# EAGLE design DesignBlockTest (EAGLE 9.6.2)
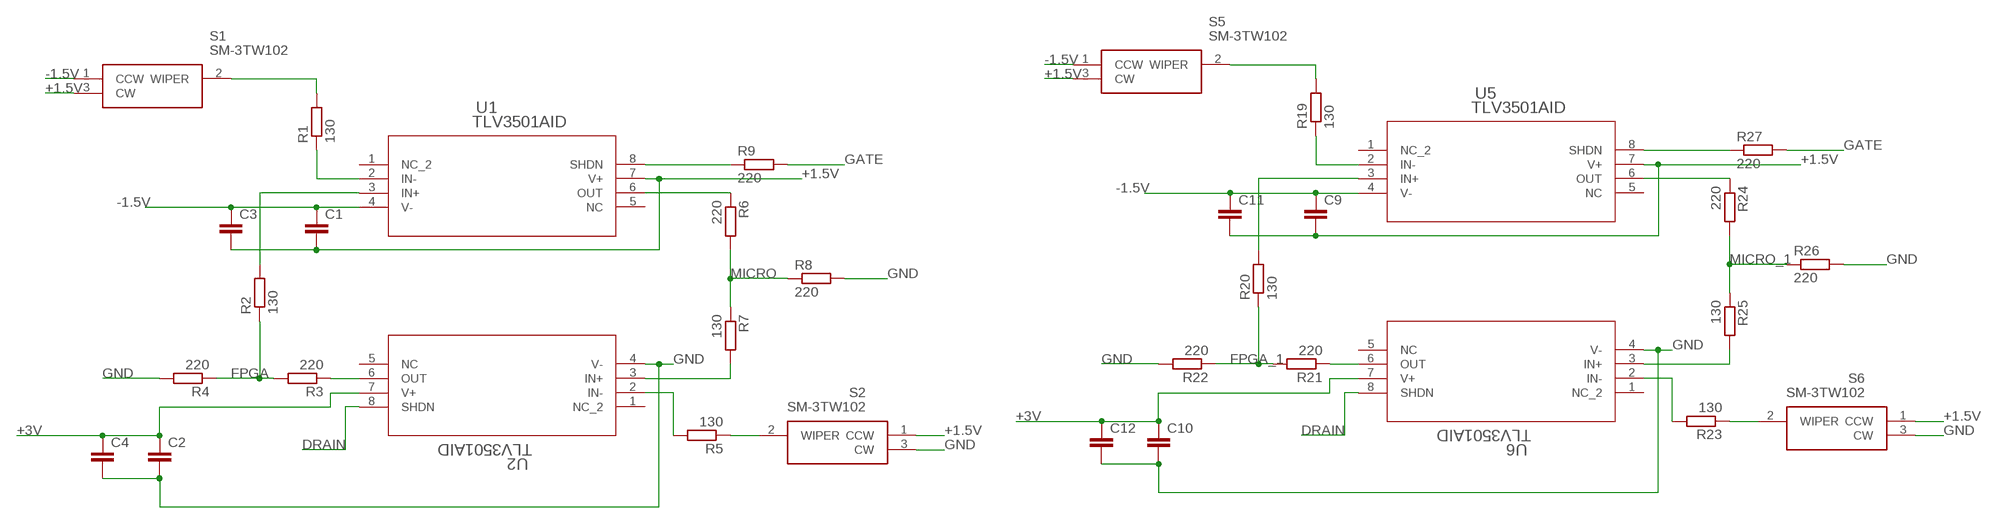
[diagram p0: schematic, sheet 1]

## Parts
C1  C-EUC0805  [C0805]
C2  C-EUC0805  [C0805]
C3  C-EUC0805  [C0805]
C4  C-EUC0805  [C0805]
C9  C-EUC0805  [C0805]
C10  C-EUC0805  [C0805]
C11  C-EUC0805  [C0805]
C12  C-EUC0805  [C0805]
R1  130  R-EU_R0805  [R0805]
R2  130  R-EU_R0603  [R0603]
R3  220  R-EU_R0805  [R0805]
R4  220  R-EU_R0805  [R0805]
R5  130  R-EU_R0805  [R0805]
R6  220  R-EU_R0805  [R0805]
R7  130  R-EU_R0805  [R0805]
R8  220  R-EU_R0805  [R0805]
R9  220  R-EU_R0805  [R0805]
R19  130  R-EU_R0805  [R0805]
R20  130  R-EU_R0603  [R0603]
R21  220  R-EU_R0805  [R0805]
R22  220  R-EU_R0805  [R0805]
R23  130  R-EU_R0805  [R0805]
R24  220  R-EU_R0805  [R0805]
R25  130  R-EU_R0805  [R0805]
R26  220  R-EU_R0805  [R0805]
R27  220  R-EU_R0805  [R0805]
S1  SM-3TW102  [SM3TW102]
S2  SM-3TW102  [SM3TW102]
S5  SM-3TW102  [SM3TW102]
S6  SM-3TW102  [SM3TW102]
U1  TLV3501AID  [D8]
U2  TLV3501AID  [D8]
U5  TLV3501AID  [D8]
U6  TLV3501AID  [D8]

## Nets
+1.5V: C1.2 C3.2 C9.2 C11.2 S1.3(CW) S2.1(CCW) S5.3(CW) S6.1(CCW) U1.7(V+) U5.7(V+)
+3V: C2.1 C4.1 C10.1 C12.1 U2.7(V+) U6.7(V+)
-1.5V: C1.1 C3.1 C9.1 C11.1 S1.1(CCW) S5.1(CCW) U1.4(V-) U5.4(V-)
DRAIN: U2.8(SHDN) U6.8(SHDN)
FPGA: R2.1 R3.2 R4.1
FPGA_1: R20.1 R21.2 R22.1
GATE: R9.2 R27.2
GND: C2.2 C4.2 C10.2 C12.2 R4.2 R8.2 R22.2 R26.2 S2.3(CW) S6.3(CW) U2.4(V-) U6.4(V-)
MICRO: R6.2 R7.1 R8.1
MICRO_1: R24.2 R25.1 R26.1
N$1: R1.2 S1.2(WIPER)
N$2: R1.1 U1.2(IN-)
N$3: R2.2 U1.3(IN+)
N$5: R3.1 U2.6(OUT)
N$6: R5.1 S2.2(WIPER)
N$7: R5.2 U2.2(IN-)
N$8: R7.2 U2.3(IN+)
N$10: R6.1 U1.6(OUT)
N$11: R9.1 U1.8(SHDN)
N$19: R19.2 S5.2(WIPER)
N$20: R19.1 U5.2(IN-)
N$21: R20.2 U5.3(IN+)
N$22: R21.1 U6.6(OUT)
N$23: R23.1 S6.2(WIPER)
N$24: R23.2 U6.2(IN-)
N$25: R25.2 U6.3(IN+)
N$26: R24.1 U5.6(OUT)
N$27: R27.1 U5.8(SHDN)
Unconnected: U1.1(NC_2) U1.5(NC) U2.1(NC_2) U2.5(NC) U5.1(NC_2) U5.5(NC) U6.1(NC_2) U6.5(NC)

## Library data of the parts
C1-C4 C9-C12 = rcl:C-EU: CAPACITOR, European symbol; SPICEPREFIX: C
R1-R9 R19-R27 = rcl:R-EU_: RESISTOR, European symbol; SPICEPREFIX: R
S1 S2 S5 S6 = SM-3TW102:SM-3TW102: Trimmer Resistors - SMD 1 KW 3mm SMD multi turn J-lead, top adj., 11 turn Source: Datasheet <https://www.mouser.it/ProductDetail/Nidec-Copal/SM-3TW102/?qs=XeJtXLiO41QfszlUsJazpw==>; DESCRIPTION: Trimmer Resistors - SMD 1 KW 3mm SMD multi turn J-lead, top adj., 11 turn; HEIGHT: 4.5mm; MANUFACTURER_NAME: NIDEC COPAL; MANUFACTURER_PART_NUMBER: SM-3TW102; MOUSER_PART_NUMBER: 229-SM-3TW102; MOUSER_PRICE-STOCK: https://www.mouser.co.uk/ProductDetail/Nidec-Copal/SM-3TW102?qs=XeJtXLiO41QfszlUsJazpw%3D%3D
U1 U2 U5 U6 = TLV3501:TLV3501AID; COPYRIGHT: Copyright (C) 2022 Ultra Librarian. All rights reserved.; DIGI-KEY_PART_NUMBER_1: 296-17921-5-ND; DIGI-KEY_PART_NUMBER_2: 2156-TLV3501AID-ND; MANUFACTURER_PART_NUMBER: TLV3501AID; MFR_NAME: Texas Instruments

## Board
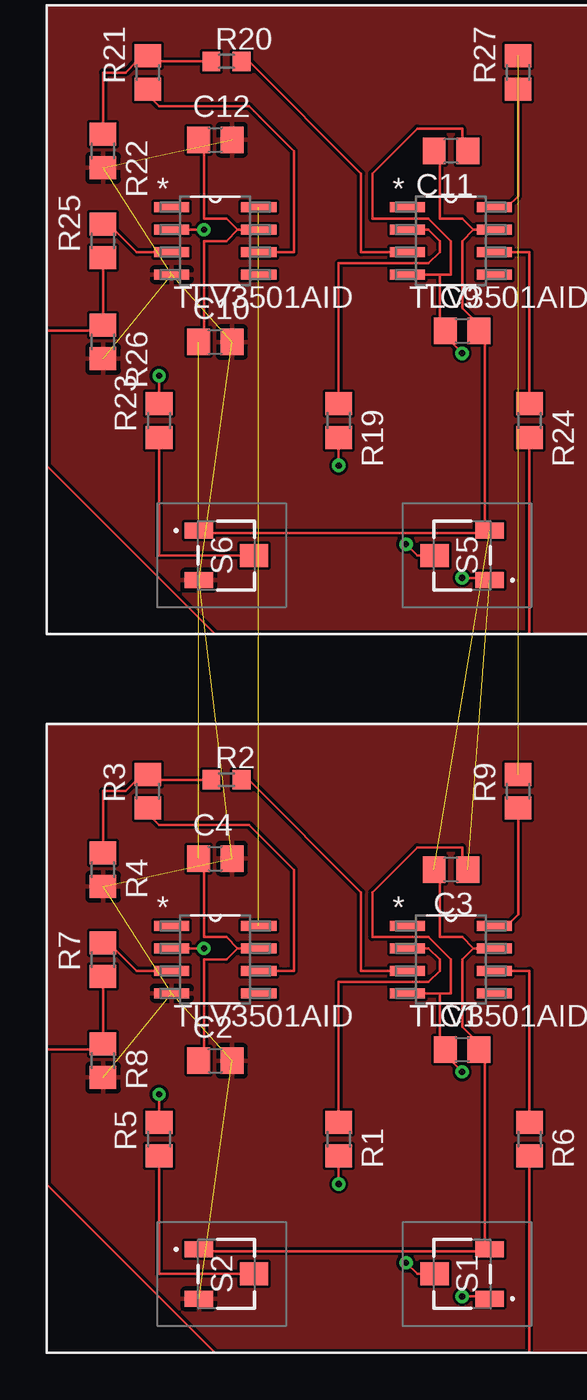
[diagram p1: board, top side]
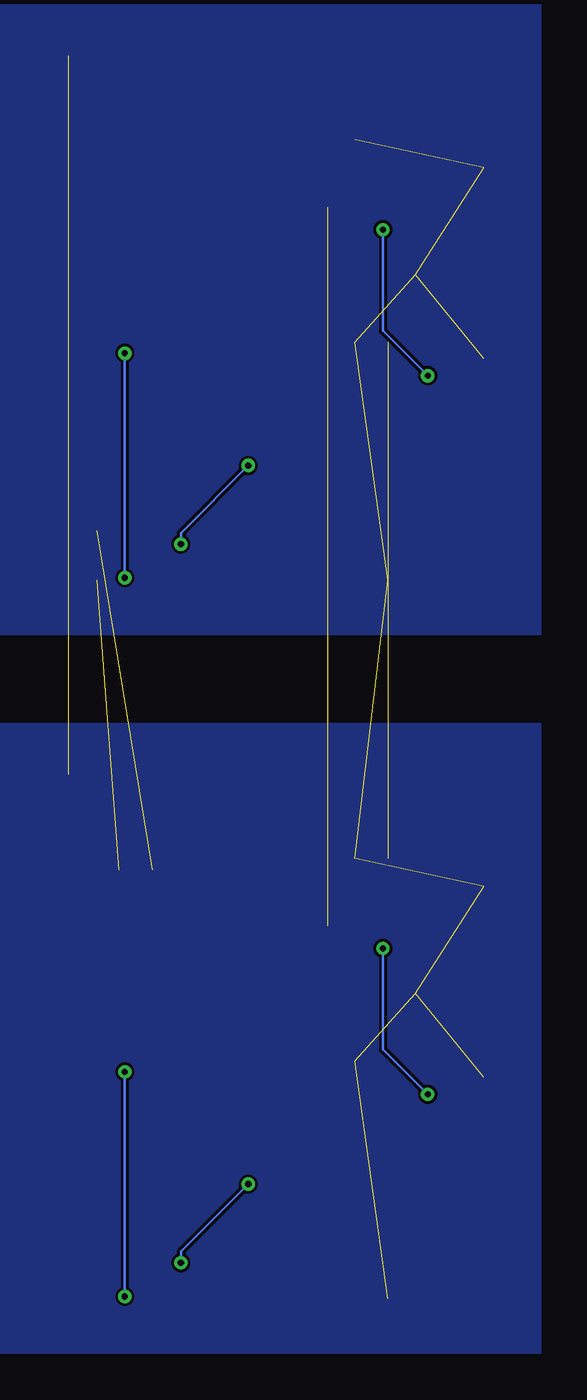
[diagram p2: board, bottom side, seen from below]

No outline drawn. Coordinates in mm, seen from the top.
Copper layers (1*16): Top 0.035mm / dielectric 1.5mm / Bottom 0.035mm
Design rules "default": minimum track width 6mil, minimum drill 0.35mm, track to track 6mil, track to pad 6mil, pad to pad 6mil, via to via 6mil, smd to smd 6mil, copper to edge 40mil, drill to drill 6mil, minimum pad ring 10mil, minimum via ring 8mil, stop-mask expansion 4mil, vias tented up to drill 0mil, thermal gap 10mil

### Footprints (pad centres in the part's own frame; a part is rotated, then mirrored left to right if it is on the bottom)
C0805 = smd 1.3 x 1.5: 1 -0.95,0; 2 0.95,0
R0805 = smd 1.3 x 1.5: 1 -0.95,0; 2 0.95,0
R0603 = smd 1 x 1.1: 1 -0.85,0; 2 0.85,0
SM3TW102 = smd 0.9 x 1.6: 1 -1.4,-1.56; 3 1.4,-1.56 | smd 1.3 x 1.6: 2 0,1.56
D8 = smd 1.981 x 0.559: 1 -2.464,1.905; 2 -2.464,0.635; 3 -2.464,-0.635; 4 -2.464,-1.905; 5 2.464,-1.905; 6 2.464,-0.635; 7 2.464,0.635; 8 2.464,1.905

### Placement (x,y rotation side)
C1  30.48,-29.84 0 top
C2  16.51,-30.48 0 top
C3  29.84,-19.68 180 top
C4  16.51,-19.05 0 top
C9  30.48,10.79 0 top
C10  16.51,10.16 0 top
C11  29.84,20.95 180 top
C12  16.51,21.59 0 top
R1  23.5,-34.92 270 top
R2  17.14,-14.61 0 top
R3  12.7,-15.24 90 top
R4  10.16,-19.68 270 top
R5  13.34,-34.92 90 top
R6  34.29,-34.92 270 top
R7  10.16,-24.77 90 top
R8  10.16,-30.48 270 top
R9  33.66,-15.24 90 top
R19  23.5,5.71 270 top
R20  17.14,26.04 0 top
R21  12.7,25.4 90 top
R22  10.16,20.95 270 top
R23  13.34,5.71 90 top
R24  34.29,5.71 270 top
R25  10.16,15.88 90 top
R26  10.16,10.16 270 top
R27  33.66,25.4 90 top
S1  30.48,-42.55 90 top
S2  17.14,-42.55 270 top
S5  30.48,-1.91 90 top
S6  17.14,-1.91 270 top
U1  29.84,-24.77 0 top
U2  16.51,-24.77 0 top
U5  29.84,15.88 0 top
U6  16.51,15.88 0 top

### Tracks (layer width: path | path; a pad name or v marks a point on that pad's centre or on a via)
+1.5V  (1 unrouted)
  Top 0.152: 31.11,-24.13 30.48,-23.5 29.21,-23.5 29.21,-19.68 C3.2 | U1.7 31.11,-24.13 | 31.75,-41.27 31.75,-29.84 | 31.75,-41.27 15.88,-41.27 S2.1 | 31.75,-41.27 S1.3 | 31.11,-24.13 30.48,-24.77 30.48,-28.57 31.75,-29.84 | 31.75,-29.84 C1.2 | 31.11,16.51 30.48,17.14 29.21,17.14 29.21,20.95 C11.2 | U5.7 31.11,16.51 | 31.75,-0.64 31.75,10.79 | 31.75,-0.64 15.88,-0.64 S6.1 | 31.75,-0.64 S5.3 | 31.11,16.51 30.48,15.88 30.48,12.06 31.75,10.79 | 31.75,10.79 C9.2
+3V  (1 unrouted)
  Top 0.152: 17.78,-24.13 17.14,-24.77 15.88,-24.77 15.88,-30.48 C2.1 | U2.7 17.78,-24.13 | 17.78,-24.13 17.14,-23.5 15.88,-23.5 15.88,-19.05 C4.1 | 17.78,16.51 17.14,15.88 15.88,15.88 15.88,10.16 C10.1 | U6.7 17.78,16.51 | 17.78,16.51 17.14,17.14 15.88,17.14 15.88,21.59 C12.1
-1.5V  (via drill 0.35)  (1 unrouted)
  Top 0.152: 29.21,-26.67 29.21,-29.84 | U1.4 29.21,-26.67 | 29.21,-26.67 29.84,-26.67 29.84,-24.77 28.57,-23.5 25.4,-23.5 25.4,-20.95 27.94,-18.41 30.48,-18.41 30.48,-19.68 C3.1 | v30.48,-43.81 31.75,-43.81 S1.1 | 29.21,-29.84 v30.48,-31.11 | 29.21,-29.84 C1.1 | 29.21,13.97 29.21,10.79 | U5.4 29.21,13.97 | 29.21,13.97 29.84,13.97 29.84,15.88 28.57,17.14 25.4,17.14 25.4,19.68 27.94,22.23 30.48,22.23 30.48,20.95 C11.1 | v30.48,-3.17 31.75,-3.17 S5.1 | 29.21,10.79 v30.48,9.53 | 29.21,10.79 C9.1
  Bottom 0.152: v30.48,-31.11 v30.48,-43.81 | v30.48,9.53 v30.48,-3.17
DRAIN  (1 unrouted)
FPGA
  Top 0.152: 12.7,-14.61 R2.1 | R4.1 10.16,-15.24 11.43,-15.24 12.06,-14.61 12.7,-14.61 | 12.7,-14.61 R3.2
FPGA_1
  Top 0.152: 12.7,26.04 R20.1 | R22.1 10.16,25.4 11.43,25.4 12.06,26.04 12.7,26.04 | 12.7,26.04 R21.2
GATE  (1 unrouted)
GND  (11 unrouted)
  pour Top: 6.99,-46.99 38.1,-46.99 38.1,-11.43 6.99,-11.43
  pour Bottom: 6.99,-46.99 38.1,-46.99 38.1,-11.43 6.99,-11.43
  pour Top: 6.99,-6.35 38.1,-6.35 38.1,29.21 6.99,29.21
  pour Bottom: 6.99,-6.35 38.1,-6.35 38.1,29.21 6.99,29.21
MICRO
  Top 0.152: R6.2 34.29,-46.99 16.51,-46.99 6.99,-37.47 6.99,-29.84 10.16,-29.84 R8.1 R7.1
MICRO_1
  Top 0.152: R24.2 34.29,-6.35 16.51,-6.35 6.99,3.17 6.99,10.79 10.16,10.79 R26.1 R25.1
N$1  (via drill 0.35)
  Top 0.152: v23.5,-37.47 R1.2 | v27.3,-41.91 27.94,-42.55 S1.2
  Bottom 0.152: v23.5,-37.47 27.3,-41.27 v27.3,-41.91
N$2
  Top 0.152: R1.1 23.5,-26.04 28.57,-26.04 29.21,-25.4 29.21,-24.77 28.57,-24.13 U1.2
N$3
  Top 0.152: U1.3 24.77,-25.4 24.77,-20.95 18.41,-14.61 R2.2
N$5
  Top 0.152: U2.6 20.95,-25.4 20.95,-19.68 18.41,-17.14 13.34,-17.14 12.7,-16.51 R3.1
N$6
  Top 0.152: R5.1 13.34,-42.55 S2.2
N$7  (via drill 0.35)
  Top 0.152: v13.34,-32.38 R5.2 | U2.2 v15.88,-24.13
  Bottom 0.152: v13.34,-32.38 15.88,-29.84 v15.88,-24.13
N$8
  Top 0.152: U2.3 12.06,-25.4 10.79,-24.13 10.16,-24.13 R7.2
N$10
  Top 0.152: R6.1 34.29,-25.4 U1.6
N$11
  Top 0.152: R9.1 33.66,-22.23 33.02,-22.86 U1.8
N$19  (via drill 0.35)
  Top 0.152: v23.5,3.17 R19.2 | v27.3,-1.27 27.94,-1.91 S5.2
  Bottom 0.152: v23.5,3.17 27.3,-0.64 v27.3,-1.27
N$20
  Top 0.152: R19.1 23.5,14.61 28.57,14.61 29.21,15.24 29.21,15.88 28.57,16.51 U5.2
N$21
  Top 0.152: U5.3 24.77,15.24 24.77,19.68 18.41,26.04 R20.2
N$22
  Top 0.152: U6.6 20.95,15.24 20.95,20.95 18.41,23.5 13.34,23.5 12.7,24.13 R21.1
N$23
  Top 0.152: R23.1 13.34,-1.91 S6.2
N$24  (via drill 0.35)
  Top 0.152: v13.34,8.26 R23.2 | U6.2 v15.88,16.51
  Bottom 0.152: v13.34,8.26 15.88,10.79 v15.88,16.51
N$25
  Top 0.152: U6.3 12.06,15.24 10.79,16.51 10.16,16.51 R25.2
N$26
  Top 0.152: R24.1 34.29,15.24 U5.6
N$27
  Top 0.152: R27.1 33.66,18.41 33.02,17.78 U5.8